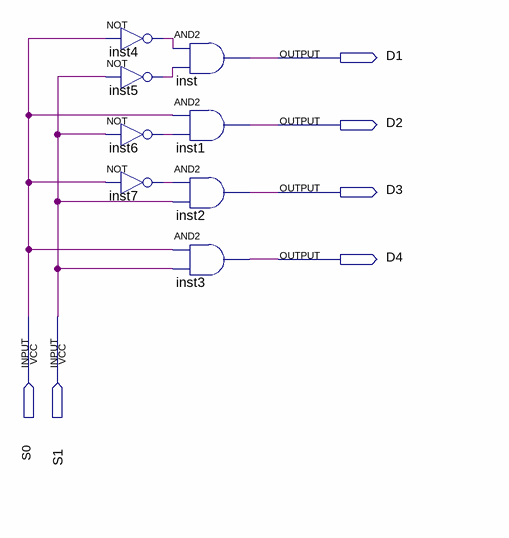
[diagram p0: schematic sheet]
// Quartus schematic 2_to_4_DeMUX.bdf as structural Verilog: 8 symbols, 6 pins
module \2_to_4_DeMUX  (
  input  S0,
  input  S1,
  output D1,
  output D2,
  output D3,
  output D4
);

  wire inst4_out, inst5_out, inst6_out, inst7_out;

  not inst4 (inst4_out, S0);
  not inst5 (inst5_out, S1);
  not inst6 (inst6_out, S1);
  not inst7 (inst7_out, S0);
  and inst (D1, inst4_out, inst5_out);
  and inst1 (D2, S0, inst6_out);
  and inst2 (D3, inst7_out, S1);
  and inst3 (D4, S0, S1);
endmodule
